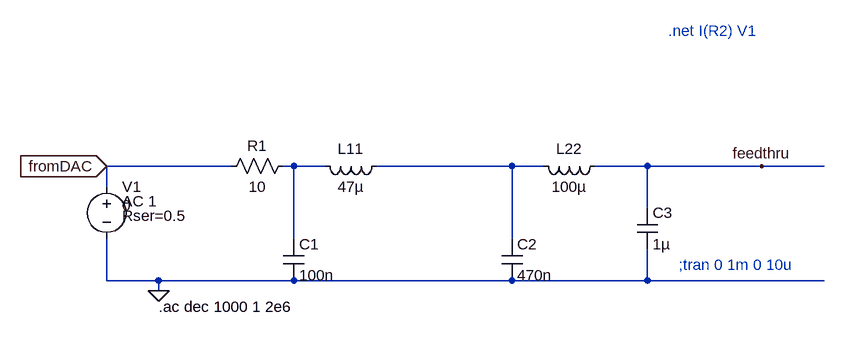
[diagram p0: schematic OFB_revB.asc]
OFB_revB.asc, the LTspice schematic file:
Version 4
SHEET 1 1368 680
WIRE 0 112 -192 112
WIRE 96 112 80 112
WIRE 144 112 96 112
WIRE 432 112 224 112
WIRE 480 112 432 112
WIRE 640 112 560 112
WIRE 816 112 640 112
WIRE 912 112 816 112
WIRE -192 144 -192 112
WIRE 640 176 640 112
WIRE 96 224 96 112
WIRE 432 224 432 112
WIRE -192 288 -192 224
WIRE -112 288 -192 288
WIRE 96 288 -112 288
WIRE 432 288 96 288
WIRE 640 288 640 240
WIRE 640 288 432 288
WIRE 912 288 640 288
WIRE -112 304 -112 288
FLAG -112 304 0
FLAG -192 112 fromDAC
IOPIN -192 112 In
FLAG 816 112 feedthru
SYMBOL cap 416 224 R0
SYMATTR InstName C2
SYMATTR Value 470n
SYMBOL cap 80 224 R0
SYMATTR InstName C1
SYMATTR Value 100n
SYMBOL voltage -192 128 R0
WINDOW 3 24 44 Left 2
WINDOW 123 24 38 Left 2
WINDOW 39 24 60 Left 2
SYMATTR Value 0
SYMATTR Value2 AC 1
SYMATTR SpiceLine Rser=0.5
SYMATTR InstName V1
SYMBOL res 96 96 R90
WINDOW 0 0 56 VBottom 2
WINDOW 3 32 56 VTop 2
SYMATTR InstName R1
SYMATTR Value 10
SYMBOL ind 240 96 R90
WINDOW 0 5 56 VBottom 2
WINDOW 3 32 56 VTop 2
SYMATTR InstName L11
SYMATTR Value 47µ
SYMATTR SpiceLine Rser=3
SYMBOL ind 576 96 R90
WINDOW 0 5 56 VBottom 2
WINDOW 3 32 56 VTop 2
SYMATTR InstName L22
SYMATTR Value 100µ
SYMATTR SpiceLine Rser=3.7
SYMBOL cap 624 176 R0
SYMATTR InstName C3
SYMATTR Value 1µ
TEXT 688 264 Left 2 ;;tran 0 1m 0 10u
TEXT -112 328 Left 2 !.ac dec 1000 1 2e6
TEXT 672 -96 Left 2 ;.net I(R2) V1

The netlist it stands for:
* OFB_revB.asc
C2 N002 0 470n
C1 N001 0 100n
V1 fromDAC 0 0 AC 1 Rser=0.5
R1 N001 fromDAC 10
L11 N002 N001 47µ Rser=3
L22 feedthru N002 100µ Rser=3.7
C3 feedthru 0 1µ
* ;tran 0 1m 0 10u
.ac dec 1000 1 2e6
* .net I(R2) V1
.backanno
.end